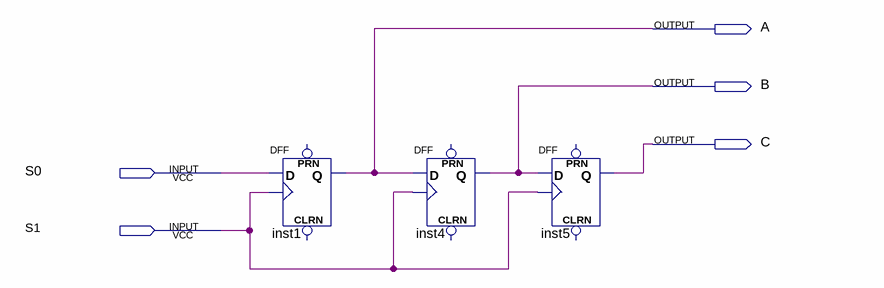
[diagram p0: schematic sheet]
// Quartus schematic exercise1.bdf as structural Verilog: 3 symbols, 5 pins
module exercise1 (
  input  S0,
  input  S1,
  output A,
  output B,
  output C
);

  DFF inst1 (.CLK(S1), .D(S0), .Q(A));  // open: CLRN, PRN
  DFF inst4 (.CLK(S1), .D(A), .Q(B));  // open: CLRN, PRN
  DFF inst5 (.CLK(S1), .D(B), .Q(C));  // open: CLRN, PRN
endmodule
